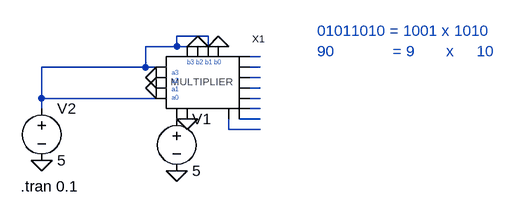
[diagram p0: schematic verification.asc]
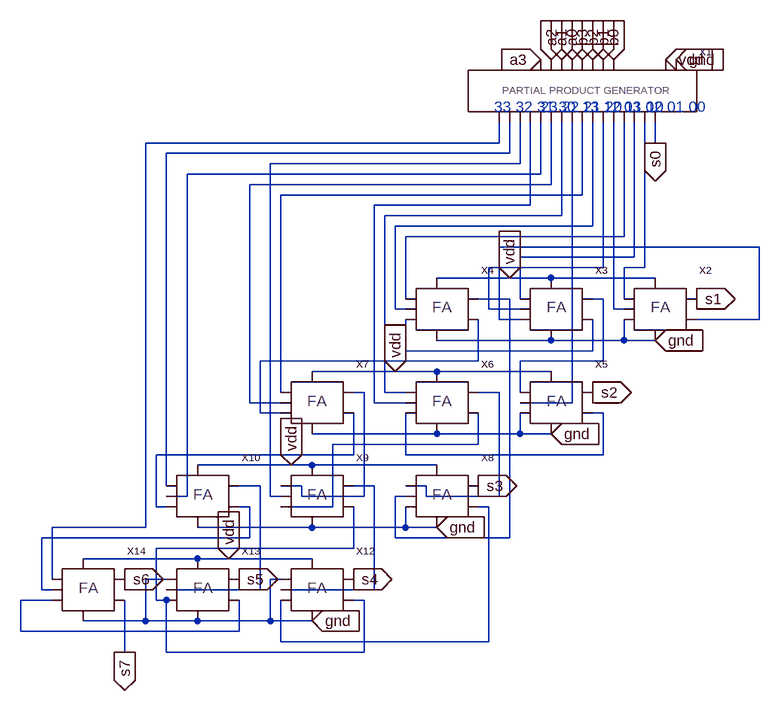
[diagram p1: sub-circuit array_multiplier.asc]
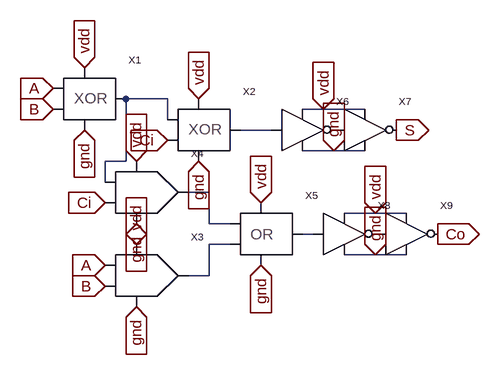
[diagram p2: sub-circuit fa.asc]
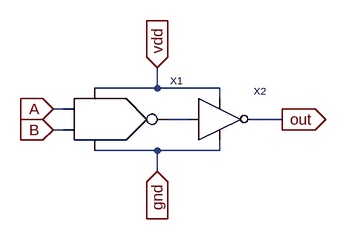
[diagram p3: sub-circuit and.asc]
verification.asc, the LTspice schematic file:
Version 4.1
SHEET 1 880 680
WIRE 240 80 192 80
WIRE 192 96 192 80
WIRE 192 96 144 96
WIRE 208 96 192 96
WIRE 240 96 240 80
WIRE 320 112 304 112
WIRE 144 128 144 96
WIRE 144 128 -16 128
WIRE 160 128 144 128
WIRE 320 128 304 128
WIRE 320 144 304 144
WIRE 320 160 304 160
WIRE -16 176 -16 128
WIRE 160 176 -16 176
WIRE 320 176 304 176
WIRE -16 192 -16 176
WIRE 320 192 304 192
WIRE 320 208 288 208
WIRE 272 224 272 208
WIRE 320 224 272 224
FLAG 192 288 0
FLAG 208 208 0
FLAG 224 96 0
FLAG 256 96 0
FLAG 160 144 0
FLAG 160 160 0
FLAG -16 272 0
DATAFLAG 320 224 ""
DATAFLAG 320 208 ""
DATAFLAG 320 192 ""
DATAFLAG 320 176 ""
DATAFLAG 320 160 ""
DATAFLAG 320 144 ""
DATAFLAG 320 128 ""
DATAFLAG 320 112 ""
SYMBOL array_multiplier 224 160 R0
SYMATTR InstName X1
SYMBOL voltage 192 192 R0
WINDOW 123 0 0 Left 0
WINDOW 39 0 0 Left 0
SYMATTR InstName V1
SYMATTR Value 5
SYMBOL voltage -16 176 R0
WINDOW 123 0 0 Left 0
WINDOW 39 0 0 Left 0
SYMATTR InstName V2
SYMATTR Value 5
TEXT 208 120 Left 0 ;b3 b2 b1 b0
TEXT 184 136 Left 0 ;a3\na2\na1\na0
TEXT -48 312 Left 2 !.tran 0.1
TEXT 408 72 Left 2 ;01011010 = 1001 x 1010\n90             = 9       x     10

array_multiplier.asc, the sub-circuit schematic file:
Version 4.1
SHEET 1 880 1096
WIRE 48 224 48 192
WIRE 48 224 -496 224
WIRE 288 224 288 192
WIRE 64 240 64 192
WIRE 64 240 -464 240
WIRE 80 256 80 192
WIRE 80 256 -304 256
WIRE 112 272 112 192
WIRE 112 272 -432 272
WIRE 128 288 128 192
WIRE 128 288 -336 288
WIRE 176 304 176 192
WIRE 176 304 -288 304
WIRE 96 320 96 192
WIRE 96 320 -144 320
WIRE 144 336 144 192
WIRE 144 336 -128 336
WIRE 192 352 192 192
WIRE 192 352 -112 352
WIRE 240 368 240 192
WIRE 240 368 -96 368
WIRE 448 384 48 384
WIRE 256 400 256 192
WIRE 256 400 80 400
WIRE 208 416 208 192
WIRE 208 416 32 416
WIRE 272 416 272 192
WIRE 272 416 240 416
WIRE 64 432 -48 432
WIRE 128 432 64 432
WIRE 288 432 128 432
WIRE -96 464 -96 368
WIRE 64 464 16 464
WIRE 80 464 80 400
WIRE 208 464 192 464
WIRE 240 464 240 416
WIRE -112 480 -112 352
WIRE -96 480 -112 480
WIRE 32 480 32 416
WIRE 80 480 32 480
WIRE 224 480 224 192
WIRE 240 480 224 480
WIRE 48 496 48 384
WIRE 80 496 48 496
WIRE 448 496 448 384
WIRE 448 496 352 496
WIRE 128 528 -48 528
WIRE 240 528 240 496
WIRE 240 528 128 528
WIRE 288 528 240 528
WIRE -96 544 -96 496
WIRE 192 544 192 496
WIRE 192 544 -96 544
WIRE 16 560 16 496
WIRE 16 560 -320 560
WIRE 208 560 208 464
WIRE 208 560 80 560
WIRE -112 576 -240 576
WIRE -48 576 -112 576
WIRE 128 576 -48 576
WIRE -288 608 -288 304
WIRE -160 608 -176 608
WIRE -128 608 -128 336
WIRE -96 608 -128 608
WIRE 48 608 16 608
WIRE 80 608 80 560
WIRE -336 624 -336 288
WIRE -288 624 -336 624
WIRE -144 624 -144 320
WIRE -96 624 -144 624
WIRE 160 624 160 192
WIRE 160 624 80 624
WIRE -320 640 -320 560
WIRE -288 640 -320 640
WIRE 208 640 192 640
WIRE -48 672 -240 672
WIRE 80 672 80 640
WIRE 80 672 -48 672
WIRE 128 672 80 672
WIRE 16 688 16 640
WIRE 16 688 -208 688
WIRE -176 704 -176 640
WIRE -176 704 -480 704
WIRE -96 704 -96 640
WIRE 208 704 208 640
WIRE 208 704 -96 704
WIRE -272 720 -416 720
WIRE -240 720 -272 720
WIRE -48 720 -240 720
WIRE -464 752 -464 240
WIRE -320 752 -352 752
WIRE -256 752 -288 752
WIRE -144 752 -176 752
WIRE -64 752 -96 752
WIRE -432 768 -432 272
WIRE -432 768 -464 768
WIRE -304 768 -304 256
WIRE -288 768 -304 768
WIRE -256 768 -256 752
WIRE -160 768 -160 608
WIRE -160 768 -256 768
WIRE -96 768 -112 768
WIRE -64 768 -64 752
WIRE 48 768 48 608
WIRE 48 768 -64 768
WIRE -480 784 -480 704
WIRE -464 784 -480 784
WIRE -336 784 -352 784
WIRE -208 784 -208 688
WIRE -208 784 -288 784
WIRE 32 784 16 784
WIRE -496 816 -496 224
WIRE -496 816 -640 816
WIRE -240 816 -416 816
WIRE -96 816 -96 784
WIRE -96 816 -240 816
WIRE -48 816 -96 816
WIRE -336 832 -336 784
WIRE -336 832 -656 832
WIRE -112 832 -112 768
WIRE 64 832 64 464
WIRE 64 832 -112 832
WIRE -176 848 -176 784
WIRE -176 848 -480 848
WIRE -416 864 -592 864
WIRE -368 864 -416 864
WIRE -240 864 -368 864
WIRE -640 896 -640 816
WIRE -464 896 -496 896
WIRE -288 896 -304 896
WIRE -656 912 -656 832
WIRE -640 912 -656 912
WIRE -320 912 -320 752
WIRE -320 912 -464 912
WIRE -144 912 -144 752
WIRE -144 912 -288 912
WIRE -640 928 -688 928
WIRE -480 928 -480 848
WIRE -464 928 -480 928
WIRE -160 928 -176 928
WIRE -496 960 -496 896
WIRE -496 960 -592 960
WIRE -416 960 -496 960
WIRE -304 960 -304 896
WIRE -304 960 -416 960
WIRE -240 960 -304 960
WIRE -688 976 -688 928
WIRE -352 976 -352 928
WIRE -352 976 -688 976
WIRE -288 992 -288 928
WIRE 32 992 32 784
WIRE 32 992 -288 992
WIRE -528 1008 -528 928
WIRE -464 1008 -464 928
WIRE -160 1008 -160 928
WIRE -160 1008 -464 1008
FLAG 304 96 vdd
IOPIN 304 96 In
FLAG 320 96 gnd
IOPIN 320 96 In
FLAG 224 96 b0
IOPIN 224 96 In
FLAG 208 96 b1
IOPIN 208 96 In
FLAG 192 96 b2
IOPIN 192 96 In
FLAG 176 96 b3
IOPIN 176 96 In
FLAG 160 96 a0
IOPIN 160 96 In
FLAG 144 96 a1
IOPIN 144 96 In
FLAG 128 96 a2
IOPIN 128 96 In
FLAG 112 96 a3
IOPIN 112 96 In
FLAG 288 224 s0
IOPIN 288 224 Out
FLAG 64 432 vdd
IOPIN 64 432 In
FLAG -112 576 vdd
IOPIN -112 576 In
FLAG -272 720 vdd
IOPIN -272 720 In
FLAG -368 864 vdd
IOPIN -368 864 In
FLAG 128 672 gnd
IOPIN 128 672 In
FLAG -48 816 gnd
IOPIN -48 816 In
FLAG -240 960 gnd
IOPIN -240 960 In
FLAG 288 528 gnd
IOPIN 288 528 In
FLAG 352 464 s1
IOPIN 352 464 Out
FLAG 192 608 s2
IOPIN 192 608 Out
FLAG 16 752 s3
IOPIN 16 752 Out
FLAG -176 896 s4
IOPIN -176 896 Out
FLAG -352 896 s5
IOPIN -352 896 Out
FLAG -528 896 s6
IOPIN -528 896 Out
FLAG -528 1008 s7
IOPIN -528 1008 Out
SYMBOL partial_product_generator 176 144 R0
SYMATTR InstName X1
SYMBOL fa 288 480 R0
SYMATTR InstName X2
SYMBOL fa 128 480 R0
SYMATTR InstName X3
SYMBOL fa -48 480 R0
SYMATTR InstName X4
SYMBOL fa 128 624 R0
SYMATTR InstName X5
SYMBOL fa -48 624 R0
SYMATTR InstName X6
SYMBOL fa -240 624 R0
SYMATTR InstName X7
SYMBOL fa -48 768 R0
SYMATTR InstName X8
SYMBOL fa -240 768 R0
SYMATTR InstName X9
SYMBOL fa -416 768 R0
SYMATTR InstName X10
SYMBOL fa -240 912 R0
SYMATTR InstName X12
SYMBOL fa -416 912 R0
SYMATTR InstName X13
SYMBOL fa -592 912 R0
SYMATTR InstName X14
TEXT 40 168 Left 0 ;33 32 31 30
TEXT 112 168 Left 0 ;23 22 21 20
TEXT 176 168 Left 0 ;13 12 11 10
TEXT 240 168 Left 0 ;03 02 01 00

fa.asc, the sub-circuit schematic file:
Version 4.1
SHEET 1 952 680
WIRE 432 16 368 16
WIRE 672 32 640 32
WIRE 736 32 672 32
WIRE 432 48 432 16
WIRE 592 64 544 64
WIRE 688 96 640 96
WIRE 736 96 688 96
WIRE 368 112 368 16
WIRE 368 112 336 112
WIRE 336 144 336 112
WIRE 496 160 464 160
WIRE 752 192 704 192
WIRE 800 192 752 192
WIRE 496 208 496 160
WIRE 528 208 496 208
WIRE 656 224 640 224
WIRE 528 240 496 240
WIRE 752 256 704 256
WIRE 800 256 752 256
WIRE 496 288 496 240
WIRE 496 288 464 288
FLAG 256 0 A
IOPIN 256 0 In
FLAG 256 32 B
IOPIN 256 32 In
FLAG 336 272 A
IOPIN 336 272 In
FLAG 336 304 B
IOPIN 336 304 In
FLAG 336 176 Ci
IOPIN 336 176 In
FLAG 432 80 Ci
IOPIN 432 80 In
FLAG 304 -32 vdd
IOPIN 304 -32 In
FLAG 480 16 vdd
IOPIN 480 16 In
FLAG 384 112 vdd
IOPIN 384 112 In
FLAG 576 176 vdd
IOPIN 576 176 In
FLAG 384 240 vdd
IOPIN 384 240 In
FLAG 304 64 gnd
IOPIN 304 64 In
FLAG 480 112 gnd
IOPIN 480 112 In
FLAG 384 336 gnd
IOPIN 384 336 In
FLAG 576 272 gnd
IOPIN 576 272 In
FLAG 384 208 gnd
IOPIN 384 208 In
FLAG 672 32 vdd
IOPIN 672 32 In
FLAG 752 192 vdd
IOPIN 752 192 In
FLAG 784 64 S
IOPIN 784 64 Out
FLAG 848 224 Co
IOPIN 848 224 Out
FLAG 688 96 gnd
IOPIN 688 96 In
FLAG 752 256 gnd
IOPIN 752 256 In
SYMBOL xor 304 16 R0
SYMATTR InstName X1
SYMBOL xor 480 64 R0
SYMATTR InstName X2
SYMBOL and 384 288 R0
SYMATTR InstName X3
SYMBOL and 384 160 R0
SYMATTR InstName X4
SYMBOL or 576 224 R0
SYMATTR InstName X5
SYMBOL inv 640 64 R0
SYMATTR InstName X6
SYMBOL inv 736 64 R0
SYMATTR InstName X7
SYMBOL inv 704 224 R0
SYMATTR InstName X8
SYMBOL inv 800 224 R0
SYMATTR InstName X9

and.asc, the sub-circuit schematic file:
Version 4.1
SHEET 1 880 680
WIRE 304 112 304 80
WIRE 304 112 208 112
WIRE 400 112 304 112
WIRE 400 128 400 112
WIRE 160 144 144 144
WIRE 352 160 320 160
WIRE 496 160 448 160
WIRE 160 176 144 176
WIRE 304 208 208 208
WIRE 400 208 400 192
WIRE 400 208 304 208
WIRE 304 240 304 208
FLAG 144 144 A
IOPIN 144 144 In
FLAG 144 176 B
IOPIN 144 176 In
FLAG 304 80 vdd
IOPIN 304 80 In
FLAG 304 240 gnd
IOPIN 304 240 In
FLAG 496 160 out
IOPIN 496 160 Out
SYMBOL nand 208 160 R0
SYMATTR InstName X1
SYMBOL inv 400 160 R0
SYMATTR InstName X2

The netlist it stands for:
* verification.asc
X§X1 N001 0 0 N001 N001 0 N001 0 P001 0 N009 N008 N007 N006 N005 N004 N003 N002 array_multiplier
V1 P001 0 5
V2 N001 0 5

* block symbol definitions
.subckt array_multiplier a3 a2 a1 a0 b3 b2 b1 b0 vdd gnd s7 s6 s5 s4 s3 s2 s1 s0
X§X1 s0 N014 N012 N010 N017 N013 N009 N006 N022 N008 N005 N004 N007 N003 N002 N001 a3 a2 a1 a0 b3 b2 b1 b0 vdd gnd partial_product_generator  ; pins b0a0 b0a1 b0a2 b0a3 b1a0 b1a1 b1a2 b1a3 b2a0 b2a1 b2a2 b2a3 b3a0 b3a1 b3a2 b3a3 a3 a2 a1 a0 b3 b2 b1 b0 vdd gnd
X§X2 vdd gnd s1 N011 N014 N017 gnd fa
X§X3 vdd gnd N016 N018 N012 N013 N011 fa
X§X4 vdd gnd N015 N019 N010 N009 N018 fa
X§X5 vdd gnd s2 N023 N016 N022 gnd fa
X§X6 vdd gnd N021 N024 N008 N007 N023 fa
X§X7 vdd gnd N020 N025 N006 N005 N019 fa
X§X8 vdd gnd s3 N029 N021 N015 gnd fa
X§X9 vdd gnd N027 N030 N020 N003 N024 fa
X§X10 vdd gnd N026 N028 N002 N004 N025 fa
X§X12 vdd gnd s4 N030 gnd N027 N029 fa
X§X13 vdd gnd s5 N031 gnd N026 N030 fa
X§X14 vdd gnd s6 s7 N001 N028 N031 fa
* 33 32 31 30
* 23 22 21 20
* 13 12 11 10
* 03 02 01 00
.ends array_multiplier

.subckt fa vdd gnd S Co A B Ci
X§X1 A B gnd vdd N001 xor  ; pins A B gnd vdd out
X§X2 N001 Ci gnd vdd N002 xor  ; pins A B gnd vdd out
X§X3 vdd A B gnd N005 and
X§X4 vdd N001 Ci gnd N003 and
X§X5 N003 N005 vdd gnd N004 or  ; pins A B vdd gnd out
X§X6 P001 N002 vdd gnd inv  ; pins out in vdd gnd
X§X7 S P001 vdd gnd inv  ; pins out in vdd gnd
X§X8 P002 N004 vdd gnd inv  ; pins out in vdd gnd
X§X9 Co P002 vdd gnd inv  ; pins out in vdd gnd
.ends fa

.subckt and vdd A B gnd out
X§X1 A B N001 vdd gnd nand  ; pins A B out vdd gnd
X§X2 out N001 vdd gnd inv  ; pins out in vdd gnd
.ends and

* b3 b2 b1 b0
* a3
* a2
* a1
* a0
.tran 0.1
* 01011010 = 1001 x 1010
* 90             = 9       x     10
.backanno
.end